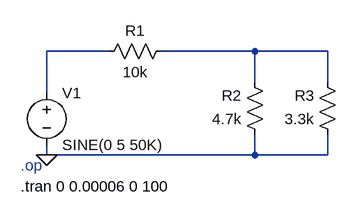
[diagram p0: schematic SimulacionAnexo.asc]
SimulacionAnexo.asc, the LTspice schematic file:
Version 4.1
SHEET 1 880 680
WIRE 144 64 48 64
WIRE 368 64 224 64
WIRE 480 64 368 64
WIRE 368 112 368 64
WIRE 480 112 480 64
WIRE 48 128 48 64
WIRE 48 224 48 208
WIRE 368 224 368 192
WIRE 368 224 48 224
WIRE 480 224 480 192
WIRE 480 224 368 224
FLAG 48 224 0
SYMBOL voltage 48 112 R0
WINDOW 123 0 0 Left 0
WINDOW 39 0 0 Left 0
SYMATTR InstName V1
SYMATTR Value SINE(0 5 50K)
SYMBOL res 240 48 R90
WINDOW 0 0 56 VBottom 2
WINDOW 3 32 56 VTop 2
SYMATTR InstName R1
SYMATTR Value 10k
SYMBOL res 384 208 R180
WINDOW 0 36 76 Left 2
WINDOW 3 36 40 Left 2
SYMATTR InstName R2
SYMATTR Value 4.7k
SYMBOL res 496 208 R180
WINDOW 0 36 76 Left 2
WINDOW 3 36 40 Left 2
SYMATTR InstName R3
SYMATTR Value 3.3k
TEXT 8 240 Left 2 ;.op
TEXT 8 272 Left 2 !.tran 0 0.00006 0 100

The netlist it stands for:
* SimulacionAnexo.asc
V1 N001 0 SINE(0 5 50K)
R1 N002 N001 10k
R2 0 N002 4.7k
R3 0 N002 3.3k
* .op
.tran 0 0.00006 0 100
.backanno
.end